# Altium project ET-master.PrjPCB
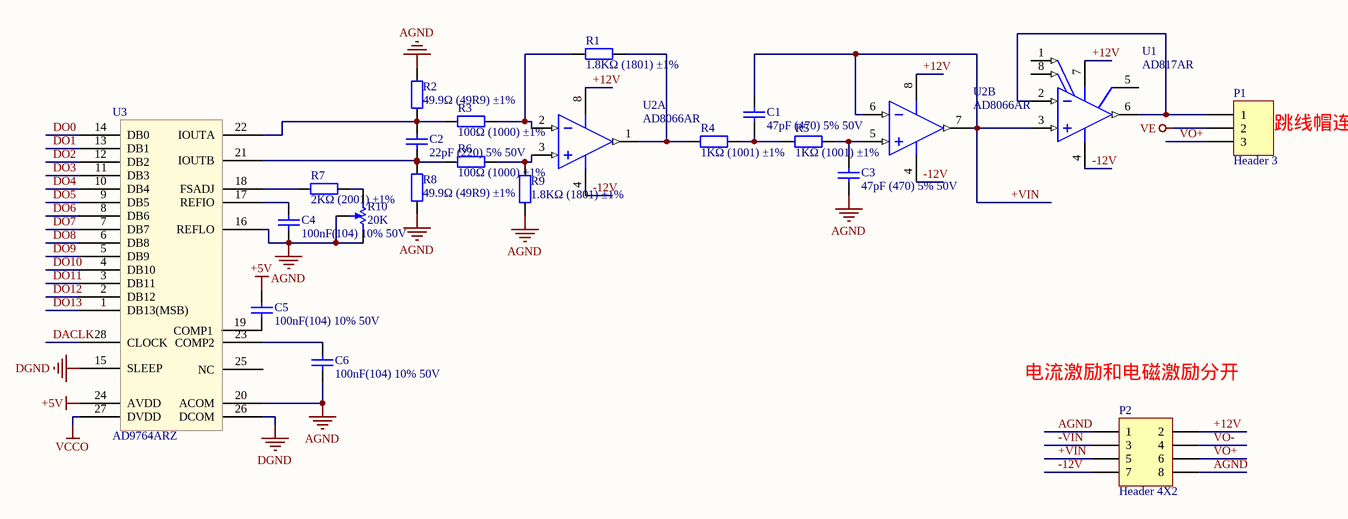
[diagram p0: ET-DAC.SchDoc]
3 sheets, 65 parts. Net scope: global (net labels, ports and power ports of the same name join across sheets).
Board file: ET-master.PcbDoc
Sheets:
  ET-DAC.SchDoc
  ET-FLASHEEPROM.SchDoc
  ET-UARTPmod.SchDoc

## Sheet ET-DAC.SchDoc
size A4

### Parts
C1  47pF (470) 5% 50V  [LC-0805_C]
C2  22pF (220) 5% 50V  [LC-0805_C]
C3  47pF (470) 5% 50V  [LC-0805_C]
C4  100nF(104) 10% 50V  [LC-0805_C]
C5  100nF(104) 10% 50V  [LC-0805_C]
C6  100nF(104) 10% 50V  [LC-0805_C]
P1  Header 3  [HDR1X3]
P2  Header 4X2  [HDR2X4]
R1  1.8KΩ (1801) ±1%  [LC-0805_R]
R2  49.9Ω (49R9) ±1%  [LC-0805_R]
R3  100Ω (1000) ±1%  [LC-0805_R]
R4  1KΩ (1001) ±1%  [LC-0805_R]
R5  1KΩ (1001) ±1%  [LC-0805_R]
R6  100Ω (1000) ±1%  [LC-0805_R]
R7  2KΩ (2001) ±1%  [LC-0805_R]
R8  49.9Ω (49R9) ±1%  [LC-0805_R]
R9  1.8KΩ (1801) ±1%  [LC-0805_R]
R10  20K  [POT4MM-2]
U1  AD817AR  [ADI-R-8_N]
U2  AD8066AR  [ADI-R-8_N]  (parts A,B of 2)
U3  AD9764ARZ  [RU-28_N]

### Nets
+5V: C5.2 U3.24(AVDD)
AGND: C3.2 C4.1 C6.1 P2.1 P2.8 R2.2 R8.1 R9.1 R10.CW(+) R10.W U3.16(REFLO) U3.20(ACOM)
DGND: U3.15(SLEEP) U3.26(DCOM)
VCCO: U3.27(DVDD)
VE: P1.2
+12V: P2.2 U1.7(+VS) U2.8(+VS)
+VIN: C1.2 P2.5 U1.3(+IN) U2.6(-IN_2) U2.7(VOUT_2)
-12V: P2.7 U1.4(-VS) U2.4(-VS)
-VIN: P2.3
DACLK: U3.28(CLOCK)
DO0: U3.14(DB0)
DO1: U3.13(DB1)
DO2: U3.12(DB2)
DO3: U3.11(DB3)
DO4: U3.10(DB4)
DO5: U3.9(DB5)
DO6: U3.8(DB6)
DO7: U3.7(DB7)
DO8: U3.6(DB8)
DO9: U3.5(DB9)
DO10: U3.4(DB10)
DO11: U3.3(DB11)
DO12: U3.2(DB12)
DO13: U3.1(DB13(MSB))
VO+: P1.3 P2.6
VO-: P2.4
NetC1_1: C1.1 R4.2 R5.2
NetC2_1: C2.1 R6.1 R8.2 U3.21(IOUTB)
NetC2_2: C2.2 R2.1 R3.1 U3.22(IOUTA)
NetC3_1: C3.1 R5.1 U2.5(+IN_2)
NetC4_2: C4.2 U3.17(REFIO)
NetC5_1: C5.1 U3.19(COMP1)
NetC6_2: C6.2 U3.23(COMP2)
NetP1_1: P1.1 U1.2(-IN) U1.6(OUT)
NetR1_1: R1.1 R3.2 U2.2(-IN_1)
NetR1_2: R1.2 R4.1 U2.1(VOUT_1)
NetR6_2: R6.2 R9.2 U2.3(+IN_1)
NetR7_1: R7.1 U3.18(FSADJ)
NetR7_2: R7.2 R10.CCW(-)

Not connected (* = marked no-connect by the designer): U1 1(NULL) 5(NC) 8(NULL); U3 25(NC)

### Notes on the sheet
- (near P1) 跳线帽连接
- (near P2) 电流激励和电磁激励分开

### Library data of the parts
C1 C3 = 0805 47pF (470) 5% 50V: 贴片电容; ComponentLink1Description: 供应商链接; ComponentLink1URL: http://www.szlcsc.com/product/details_15529.html; Package: 0805; Supplier: LC; SuppliersPartNumber: C14857
C2 = 0805 22pF (220) 5% 50V: 贴片电容; ComponentLink1Description: 供应商链接; ComponentLink1URL: http://www.szlcsc.com/product/details_2156.html; Package: 0805; Supplier: LC; SuppliersPartNumber: C1804
C4-C6 = 0805 100nF(104) 10% 50V: 贴片电容; ComponentLink1Description: 供应商链接; ComponentLink1URL: http://www.szlcsc.com/product/details_50686.html; Package: 0805; Supplier: LC; SuppliersPartNumber: C49678
P1 = Header 3: Header, 3-Pin; LatestRevisionDate: 17-Jul-2002; LatestRevisionNote: Re-released for DXP Platform.; Publisher: Altium Limited
P2 = Header 4X2: Header, 4-Pin, Dual row; LatestRevisionDate: 17-Jul-2002; LatestRevisionNote: Re-released for DXP Platform.; Publisher: Altium Limited
R1 R9 = 0805 1.8KΩ (1801) 1%: 贴片电阻; ComponentLink1Description: 供应商链接; ComponentLink1URL: http://www.szlcsc.com/product/details_18086.html; Package: 0805; Supplier: LC; SuppliersPartNumber: C17398
R2 R8 = 0805 49.9Ω (49R9) 1%: 贴片电阻; ComponentLink1Description: 供应商链接; ComponentLink1URL: http://www.szlcsc.com/product/details_18408.html; Package: 0805; Supplier: LC; SuppliersPartNumber: C17720
R3 R6 = 0805 100Ω (1000) 1%: 贴片电阻; ComponentLink1Description: 供应商链接; ComponentLink1URL: http://www.szlcsc.com/product/details_18096.html; Package: 0805; Supplier: LC; SuppliersPartNumber: C17408
R4 R5 = 0805 1KΩ (1001) 1%: 贴片电阻; ComponentLink1Description: 供应商链接; ComponentLink1URL: http://www.szlcsc.com/product/details_18201.html; Package: 0805; Supplier: LC; SuppliersPartNumber: C17513
R7 = 0805 2KΩ (2001) 1%: 贴片电阻; ComponentLink1Description: 供应商链接; ComponentLink1URL: http://www.szlcsc.com/product/details_18292.html; Package: 0805; Supplier: LC; SuppliersPartNumber: C17604
R10 = RPot SM: Square Trimming Potentiometer; Published: 17-Dec-2003; DatasheetVersion: Oct-2003; PackageReference: POT4MM-2; Publisher: Altium Limited; PackageDescription: Square Trimming Potentiometer; ComponentLink1Description: Manufacturer Link; ComponentLink1URL: http://bourns.com/2/search.html
U1 = AD817AR: Single Channel Low Power Operational Amplifier, 50 MHz BW, 350 V/us SR, Industrial, 8-pin SOIC (R-8), Tube; Generic Part Number: AD817; Manufacturer: Analog Devices; Amplifiers Per Package: 1; Input Bias Current: 3.3uA; Input Offset Voltage: 500uV; Iq/Amp: 7.5mA; Small Signal Bandwidth: 50MHz; V Span Max: 36V; V Span Min: 5V; DatasheetVersion: Rev. B; PackageVersion: 060506-A; PackageReference: R-8; PackageDescription: 8-Pin Standard Small Outline Package, Body 3.9 x 4.9 mm, Pitch 1.27 mm; Supplier 1: Digi-Key; Supplier Part Number 1: AD817AR-ND; Slew Rate: 350V/us; Mounting Technology: Surface Mount; Code_JEDEC: MS-012-AA; PartNumber: AD817AR; ComponentLink1Description: Manufacturer URL; ComponentLink1URL: http://www.analog.com/en/index.html; ComponentLink2Description: Datasheet; ComponentLink2URL: http://www.analog.com/static/imported-files/data_sheets/AD817.pdf; ComponentLink3Description: Package Specification; ComponentLink3URL: http://www.analog.com/static/imported-files/packages/PKG_PDF/SOIC_Narrow%20(R)/R_8.pdf
U2 = AD8066AR: Double Channel Low Power Operational Amplifier, 145 MHz BW, 180 V/us SR, Industrial, 8-pin SOIC (R-8), Tube; Generic Part Number: AD8066; Manufacturer: Analog Devices; Amplifiers Per Package: 2; Input Bias Current: 2pA; Input Offset Voltage: 400uV; Iq/Amp: 7.4mA; Small Signal Bandwidth: 145MHz; V Span Max: 24V; V Span Min: 5V; DatasheetVersion: Rev. J; PackageVersion: 060506-A; PackageReference: R-8; PackageDescription: 8-Pin Standard Small Outline Package, Body 3.9 x 4.9 mm, Pitch 1.27 mm; Supplier 1: Digi-Key; Supplier Part Number 1: AD8066AR-ND; Slew Rate: 180V/us; Mounting Technology: Surface Mount; Code_JEDEC: MS-012-AA; PartNumber: AD8066AR; ComponentLink1Description: Manufacturer URL; ComponentLink1URL: http://www.analog.com/en/index.html; ComponentLink2Description: Datasheet; ComponentLink2URL: http://www.analog.com/static/imported-files/data_sheets/AD8065_8066.pdf; ComponentLink3Description: Package Specification; ComponentLink3URL: http://www.analog.com/static/imported-files/packages/PKG_PDF/SOIC_Narrow%20(R)/R_8.pdf; ComponentLink4Description: Reference Circuit; ComponentLink4URL: http://www.analog.com/en/all-operational-amplifiers-op-amps/operational-amplifiers-op-amps/ad8066/products/product.html#product-recommendations
U3 = AD9764ARZ: Imported; Manufacturer_Part_Number: AD9764ARZ; Vendor: Vendor; Value: Value; Type: Type; RefDes: Refdes

## Sheet ET-FLASHEEPROM.SchDoc
size A4
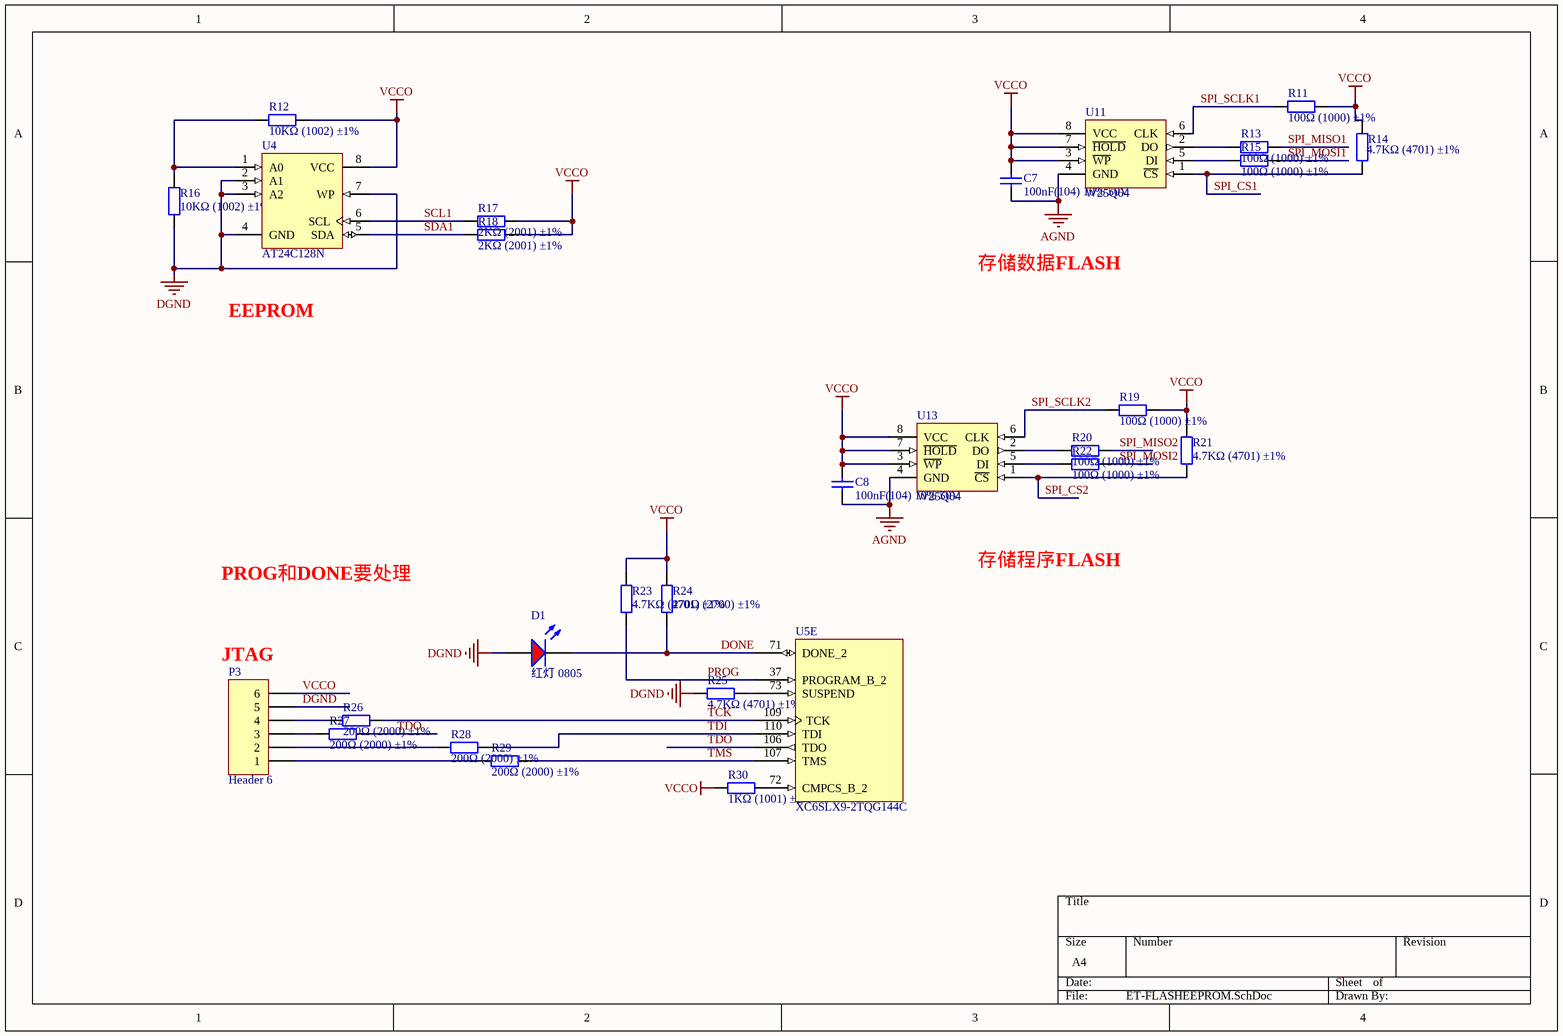
[diagram p1: ET-FLASHEEPROM.SchDoc]

### Parts
C7  100nF(104) 10% 50V  [LC-0805_C]
C8  100nF(104) 10% 50V  [LC-0805_C]
D1  红灯 0805  [LC-0805_LED_S1]
P3  Header 6  [HDR1X6]
R11  100Ω (1000) ±1%  [LC-0805_R]
R12  10KΩ (1002) ±1%  [LC-0805_R]
R13  100Ω (1000) ±1%  [LC-0805_R]
R14  4.7KΩ (4701) ±1%  [LC-0805_R]
R15  100Ω (1000) ±1%  [LC-0805_R]
R16  10KΩ (1002) ±1%  [LC-0805_R]
R17  2KΩ (2001) ±1%  [LC-0805_R]
R18  2KΩ (2001) ±1%  [LC-0805_R]
R19  100Ω (1000) ±1%  [LC-0805_R]
R20  100Ω (1000) ±1%  [LC-0805_R]
R21  4.7KΩ (4701) ±1%  [LC-0805_R]
R22  100Ω (1000) ±1%  [LC-0805_R]
R23  4.7KΩ (4701) ±1%  [LC-0805_R]
R24  270Ω (2700) ±1%  [LC-0805_R]
R25  4.7KΩ (4701) ±1%  [LC-0805_R]
R26  200Ω (2000) ±1%  [LC-0805_R]
R27  200Ω (2000) ±1%  [LC-0805_R]
R28  200Ω (2000) ±1%  [LC-0805_R]
R29  200Ω (2000) ±1%  [LC-0805_R]
R30  1KΩ (1001) ±1%  [LC-0805_R]
U4  AT24C128N  [8P3]
U5  XC6SLX9-2TQG144C  [TQG144_N]  (part E of 7)
U11  W25Q64  [LC-SOIC-8_208mil]
U13  W25Q64  [LC-SOIC-8_208mil]

### Nets
AGND: C7.1 C8.1 U11.4(GND) U13.4(GND)
DGND: D1.A P3.5 R16.1 R25.1 U4.2(A1) U4.3(A2) U4.4(GND) U4.7(WP)
VCCO: C7.2 C8.2 P3.6 R11.2 R12.2 R14.2 R17.2 R18.2 R19.2 R21.2 R23.2 R24.2 R30.1 U4.8(VCC) U11.3(~{WP}) U11.7(~{HOLD}) U11.8(VCC) U13.3(~{WP}) U13.7(~{HOLD}) U13.8(VCC)
DONE: D1.K R24.1 U5.71(DONE_2)
PROG: R23.1 U5.37(PROGRAM_B_2)
SCL1: R17.1 U4.6(SCL)
SDA1: R18.1 U4.5(SDA)
SPI_CS1: R14.1 U11.1(~{CS})
SPI_CS2: R21.1 U13.1(~{CS})
SPI_MISO1: R13.2
SPI_MISO2: R20.2
SPI_MOSI1: R15.2
SPI_MOSI2: R22.2
SPI_SCLK1: R11.1 U11.6(CLK)
SPI_SCLK2: R19.1 U13.6(CLK)
TCK: R26.2 U5.109(TCK)
TDI: R28.2 U5.110(TDI)
TDO: R27.2 U5.106(TDO)
TMS: R29.2 U5.107(TMS)
NetP3_1: P3.1 R29.1
NetP3_2: P3.2 R28.1
NetP3_3: P3.3 R27.1
NetP3_4: P3.4 R26.1
NetR12_1: R12.1 R16.2 U4.1(A0)
NetR13_1: R13.1 U11.2(DO)
NetR15_1: R15.1 U11.5(DI)
NetR20_1: R20.1 U13.2(DO)
NetR22_1: R22.1 U13.5(DI)
NetR25_2: R25.2 U5.73(SUSPEND)
NetR30_2: R30.2 U5.72(CMPCS_B_2)

### Notes on the sheet
- 存储数据FLASH
- EEPROM
- PROG和DONE要处理
- 存储程序FLASH
- (near P3) JTAG

### Library data of the parts
C7 C8 = 0805 100nF(104) 10% 50V: 贴片电容; ComponentLink1Description: 供应商链接; ComponentLink1URL: http://www.szlcsc.com/product/details_50686.html; Package: 0805; Supplier: LC; SuppliersPartNumber: C49678
D1 = 0805 红灯: 发光二极管; ComponentLink1Description: 供应商链接; ComponentLink1URL: http://www.szlcsc.com/product/details_2668.html; Package: 0805; Supplier: LC; SuppliersPartNumber: C2295
P3 = Header 6: Header, 6-Pin; LatestRevisionDate: 17-Jul-2002; LatestRevisionNote: Re-released for DXP Platform.; Publisher: Altium Limited
R11 R13 R15 R19 R20 R22 = 0805 100Ω (1000) 1%: 贴片电阻; ComponentLink1Description: 供应商链接; ComponentLink1URL: http://www.szlcsc.com/product/details_18096.html; Package: 0805; Supplier: LC; SuppliersPartNumber: C17408
R12 R16 = 0805 10KΩ (1002) 1%: 贴片电阻; ComponentLink1Description: 供应商链接; ComponentLink1URL: http://www.szlcsc.com/product/details_18102.html; Package: 0805; Supplier: LC; SuppliersPartNumber: C17414
R14 R21 R23 R25 = 0805 4.7KΩ (4701) 1%: 贴片电阻; ComponentLink1Description: 供应商链接; ComponentLink1URL: http://www.szlcsc.com/product/details_18361.html; Package: 0805; Supplier: LC; SuppliersPartNumber: C17673
R17 R18 = 0805 2KΩ (2001) 1%: 贴片电阻; ComponentLink1Description: 供应商链接; ComponentLink1URL: http://www.szlcsc.com/product/details_18292.html; Package: 0805; Supplier: LC; SuppliersPartNumber: C17604
R24 = 0805 270Ω (2700) 1%: 贴片电阻; ComponentLink1Description: 供应商链接; ComponentLink1URL: http://www.szlcsc.com/product/details_18278.html; Package: 0805; Supplier: LC; SuppliersPartNumber: C17590
R26-R29 = 0805 200Ω (2000) 1%: 贴片电阻; ComponentLink1Description: 供应商链接; ComponentLink1URL: http://www.szlcsc.com/product/details_18228.html; Package: 0805; Supplier: LC; SuppliersPartNumber: C17540
R30 = 0805 1KΩ (1001) 1%: 贴片电阻; ComponentLink1Description: 供应商链接; ComponentLink1URL: http://www.szlcsc.com/product/details_18201.html; Package: 0805; Supplier: LC; SuppliersPartNumber: C17513
U4 = AT24C128N: 1Kbit (128 x 8), 2-wire Bus Automotive Serial EEPROM with Write Protect, 2.5V, 8-Pin TSSOP, Bulk; Published: 20-Sep-2010; DatasheetVersion: 8517C,  Jan-2009; PackageVersion: revD, Dec-2009; PackageReference: 8A2; Publisher: Altium Limited; PackageDescription: 8-Lead, 4.4 mm Body, Plastic Thin Shrink Small Outline Package (TSSOP); Code_JEDEC: MO-153-AA; ComponentLink1Description: Manufacturer Link; ComponentLink1URL: http://www.atmel.com/products/serial/default.asp; ComponentLink2Description: Datasheet; ComponentLink2URL: http://www.atmel.com/dyn/resources/prod_documents/doc8517.pdf; ComponentLink3Description: Atmel.com Home; ComponentLink3URL: http://www.atmel.com
U5 = XC6SLX9-2TQG144C: Spartan-6 LX 1.2V FPGA, 102 User I/Os, 144-Pin TQFP (0.5mm Pitch), Speed Grade 2, Commercial Grade, Pb-Free; Published: 17-Nov-2009; DatasheetVersion: ver1.6, Nov-2010; PackageVersion: ver1.2, Jun-2004; PackageReference: TQG144; Publisher: Altium Limited; PackageDescription: 144-Pin Thin Quad Flat Pack (TQG144) - Pb-Free; Supplier 1: Digi-Key; Supplier Part Number 1: XC6SLX9-2TQG144C-ND; Code_JEDEC: MS-026-BFB; ComponentLink1Description: Manufacturer Link; ComponentLink1URL: http://www.xilinx.com; ComponentLink2Description: Spartan-6 Datasheet; ComponentLink2URL: http://www.xilinx.com/support/documentation/data_sheets/ds160.pdf; ComponentLink3Description: Spartan-6 Documents; ComponentLink3URL: http://www.xilinx.com/support/documentation/spartan-6.htm; ComponentLink4Description: Xilinx.com Home; ComponentLink4URL: http://www.xilinx.com

## Sheet ET-UARTPmod.SchDoc
size A4
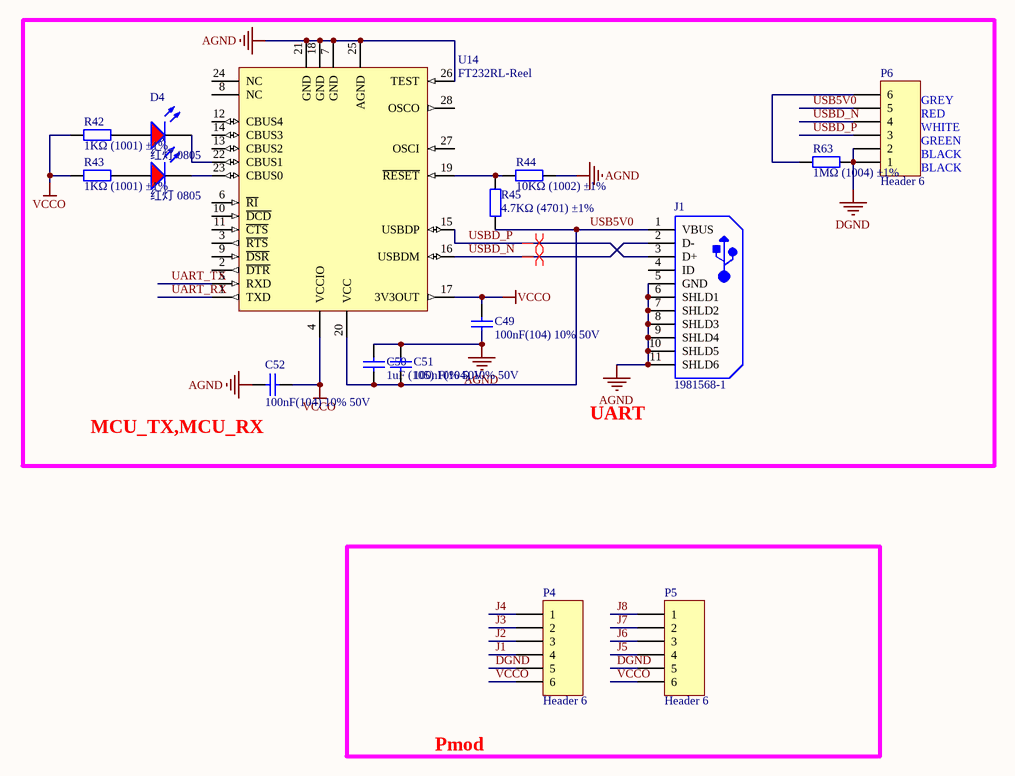
[diagram p2: ET-UARTPmod.SchDoc]

### Parts
C49  100nF(104) 10% 50V  [LC-0805_C]
C50  1uF (105) 10% 50V  [LC-0805_C]
C51  100nF(104) 10% 50V  [LC-0805_C]
C52  100nF(104) 10% 50V  [LC-0805_C]
D4  红灯 0805  [LC-0805_LED_S1]
D5  红灯 0805  [LC-0805_LED_S1]
J1  1981568-1  [TECO-1981568-5_V]
P4  Header 6  [HDR1X6]
P5  Header 6  [HDR1X6]
P6  Header 6  [HDR1X6]
R42  1KΩ (1001) ±1%  [LC-0805_R]
R43  1KΩ (1001) ±1%  [LC-0805_R]
R44  10KΩ (1002) ±1%  [LC-0805_R]
R45  4.7KΩ (4701) ±1%  [LC-0805_R]
R63  1MΩ (1004) ±1%  [LC-0805_R]
U14  FT232RL-Reel  [SSOP-28_N]

### Blocks framed on the sheet
Pmod: P4 P5

### Nets
AGND: C49.2 C50.1 C51.1 C52.1 J1.5(GND) J1.6(SHLD1) J1.7(SHLD2) J1.8(SHLD3) J1.9(SHLD4) J1.10(SHLD5) J1.11(SHLD6) R44.1 U14.7(GND) U14.18(GND) U14.21(GND) U14.25(AGND) U14.26(TEST)
DGND: P4.5 P5.5 P6.1 P6.2 R63.2
VCCO: C49.1 C52.2 P4.6 P5.6 R42.2 R43.2 U14.4(VCCIO) U14.17(3V3OUT)
J1: P4.4
J2: P4.3
J3: P4.2
J4: P4.1
J5: P5.4
J6: P5.3
J7: P5.2
J8: P5.1
UART_RX: U14.1(TXD)
UART_TX: U14.5(RXD)
USB5V0: C50.2 C51.2 J1.1(VBUS) P6.5 R45.2 U14.20(VCC)
USBD_N: J1.2(D-) P6.4 U14.16(USBDM)
USBD_P: J1.3(D+) P6.3 U14.15(USBDP)
NetD4_A: D4.A R42.1
NetD4_K: D4.K U14.22(CBUS1)
NetD5_A: D5.A R43.1
NetD5_K: D5.K U14.23(CBUS0)
NetP6_6: P6.6 R63.1
NetR44_2: R44.2 R45.1 U14.19(~{RESET})

Not connected (* = marked no-connect by the designer): J1 4(ID); U14 2(~{DTR}) 3(~{RTS}) 6(~{RI}) 8(NC) 9(~{DSR}) 10(~{DCD}) 11(~{CTS}) 12(CBUS4) 13(CBUS2) 14(CBUS3) 24(NC) 27(OSCI) 28(OSCO)

### Layout directives
differential pair: USBD_N, USBD_P

### Notes on the sheet
- MCU_TX,MCU_RX
- UART
- Labels drawn without touching a wire or pin: BLACK, GREEN, GREY, RED, WHITE

### Library data of the parts
C49 C51 C52 = 0805 100nF(104) 10% 50V: 贴片电容; ComponentLink1Description: 供应商链接; ComponentLink1URL: http://www.szlcsc.com/product/details_50686.html; Package: 0805; Supplier: LC; SuppliersPartNumber: C49678
C50 = 0805 1uF (105) 10% 50V: 贴片电容; ComponentLink1Description: 供应商链接; ComponentLink1URL: http://www.szlcsc.com/product/details_29074.html; Package: 0805; Supplier: LC; SuppliersPartNumber: C28323
D4 D5 = 0805 红灯: 发光二极管; ComponentLink1Description: 供应商链接; ComponentLink1URL: http://www.szlcsc.com/product/details_2668.html; Package: 0805; Supplier: LC; SuppliersPartNumber: C2295
J1 = 1981568-1: Micro USB Receptacle Standard Type B Assy, 5-Pin SMD, RoHS, Tape and Reel; Number of Contacts: 5 POS; Number of Ports: 1 Port; Product Length (mm): 8 mm; Gender: RCP; Current Rating (Max): 1/Contact A; Voltage Rating Max: 30VAC; Body Orientation: Right Angle; Product Depth (mm): 5.6 mm; Pitch (mm): 0.65 mm; Product Height (mm): 3 mm; DatasheetVersion: Rev. E2; PackageReference: SMD; PackageDescription: SMD, 5-Leads, Body 8x5.9mm, Pitch 0.65mm; Supplier 1: Digi-Key; Supplier Part Number 1: A97800TR-ND; Supplier 2: Digi-Key; Supplier Part Number 2: A97800CT-ND; Supplier 3: Digi-Key; Supplier Part Number 3: A97800DKR-ND; Termination Method: Solder; Operating Temperature Min Deg. C: -55C; Operating Temperature Max Deg. C: 85C; Number of Terminals: 5; Mounting Style: Surface Mount; Packaging: Tape and Reel; Housing Material: Thermoplastic; Contact Plating: Gold Over Nickel; Type: Micro USB; Contact Material: Copper Alloy; Operating Temp Range: -55C to 85C; ComponentLink1Description: Manufacturer URL; ComponentLink1URL: http://www.te.com; ComponentLink2Description: Datasheet; ComponentLink2URL: http://www.mouser.com/ds/2/418/NG_CD_1981568_E2-621296.pdf
P4-P6 = Header 6: Header, 6-Pin; LatestRevisionDate: 17-Jul-2002; LatestRevisionNote: Re-released for DXP Platform.; Publisher: Altium Limited
R42 R43 = 0805 1KΩ (1001) 1%: 贴片电阻; ComponentLink1Description: 供应商链接; ComponentLink1URL: http://www.szlcsc.com/product/details_18201.html; Package: 0805; Supplier: LC; SuppliersPartNumber: C17513
R44 = 0805 10KΩ (1002) 1%: 贴片电阻; ComponentLink1Description: 供应商链接; ComponentLink1URL: http://www.szlcsc.com/product/details_18102.html; Package: 0805; Supplier: LC; SuppliersPartNumber: C17414
R45 = 0805 4.7KΩ (4701) 1%: 贴片电阻; ComponentLink1Description: 供应商链接; ComponentLink1URL: http://www.szlcsc.com/product/details_18361.html; Package: 0805; Supplier: LC; SuppliersPartNumber: C17673
R63 = 0805 1MΩ (1004) 1%: 贴片电阻; ComponentLink1Description: 供应商链接; ComponentLink1URL: http://www.szlcsc.com/product/details_18202.html; Package: 0805; Supplier: LC; SuppliersPartNumber: C17514
U14 = FT232RL-Reel: USB UART Asynchronous Serial Data Transfer Chip, SSOP-28, Tape and Reel; Published: 19-Aug-2010; DatasheetVersion: ver 2.07, Jul-2010; PackageVersion: 2010; PackageReference: SSOP-28; Publisher: Altium Limited; PackageDescription: 28-Pin Small Outline Package 0.65 mm Pitch; ComponentLink1Description: Manufacturer Link; ComponentLink1URL: http://www.ftdichip.com/Products/ICs/FT232R.htm; ComponentLink2Description: Datasheet; ComponentLink2URL: http://www.ftdichip.com/Support/Documents/DataSheets/ICs/DS_FT232R.pdf

## Nets that join several sheets
AGND: ET-DAC (12 pins), ET-FLASHEEPROM (C7.1 C8.1 U11.4 U13.4), ET-UARTPmod (17 pins)
DGND: ET-DAC (U3.15 U3.26), ET-FLASHEEPROM (8 pins), ET-UARTPmod (5 pins)
VCCO: ET-DAC (U3.27), ET-FLASHEEPROM (20 pins), ET-UARTPmod (8 pins)